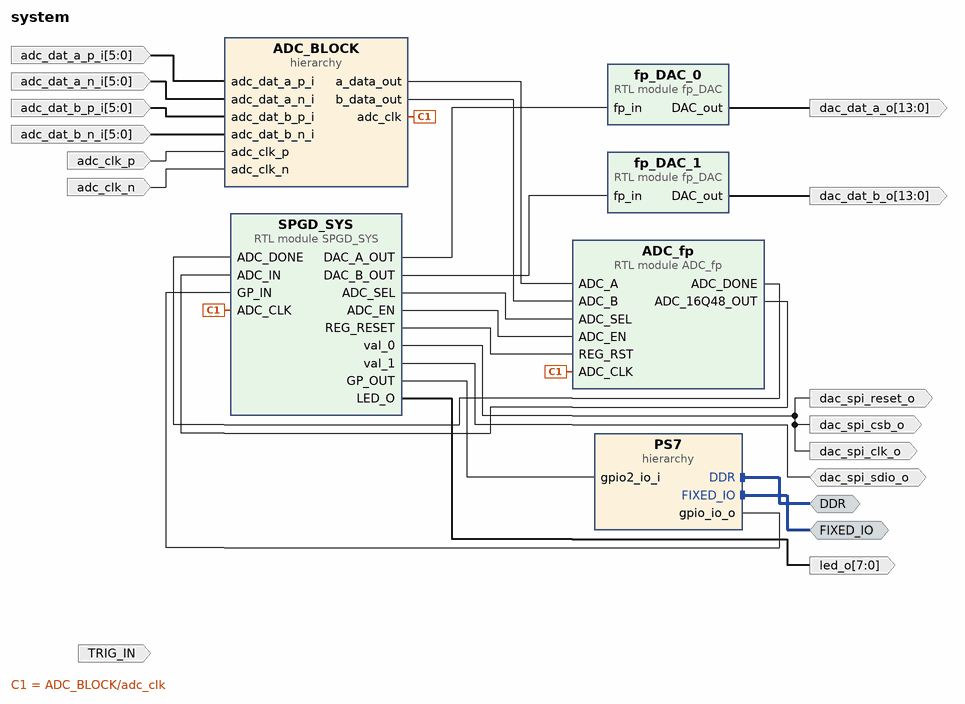
[diagram p0: block diagram of the top level]
# Vivado block design system, xc7z020clg400-3, Vivado 2020.1
create_bd_design system

create_bd_intf_port -mode Master -vlnv xilinx.com:interface:ddrx_rtl:1.0 DDR
create_bd_intf_port -mode Master -vlnv xilinx.com:display_processing_system7:fixedio_rtl:1.0 FIXED_IO
create_bd_port -dir I TRIG_IN
create_bd_port -dir I -from 5 -to 0 adc_dat_a_p_i
create_bd_port -dir I -from 5 -to 0 adc_dat_a_n_i
create_bd_port -dir I -from 5 -to 0 adc_dat_b_p_i
create_bd_port -dir I -from 5 -to 0 adc_dat_b_n_i
create_bd_port -dir I adc_clk_p
create_bd_port -dir I adc_clk_n
create_bd_port -dir O -from 13 -to 0 dac_dat_a_o
create_bd_port -dir O -from 13 -to 0 dac_dat_b_o
create_bd_port -dir O dac_spi_csb_o
create_bd_port -dir IO dac_spi_sdio_o
create_bd_port -dir O dac_spi_clk_o
create_bd_port -dir O dac_spi_reset_o
create_bd_port -dir O -from 7 -to 0 led_o

create_bd_cell -type hier PS7
create_bd_cell -type hier ADC_BLOCK
create_bd_cell -type module -reference ADC_fp ADC_fp
create_bd_cell -type module -reference fp_DAC fp_DAC_0
create_bd_cell -type module -reference fp_DAC fp_DAC_1
create_bd_cell -type module -reference SPGD_SYS SPGD_SYS

# ---- hierarchy /PS7 ----
current_bd_instance /PS7
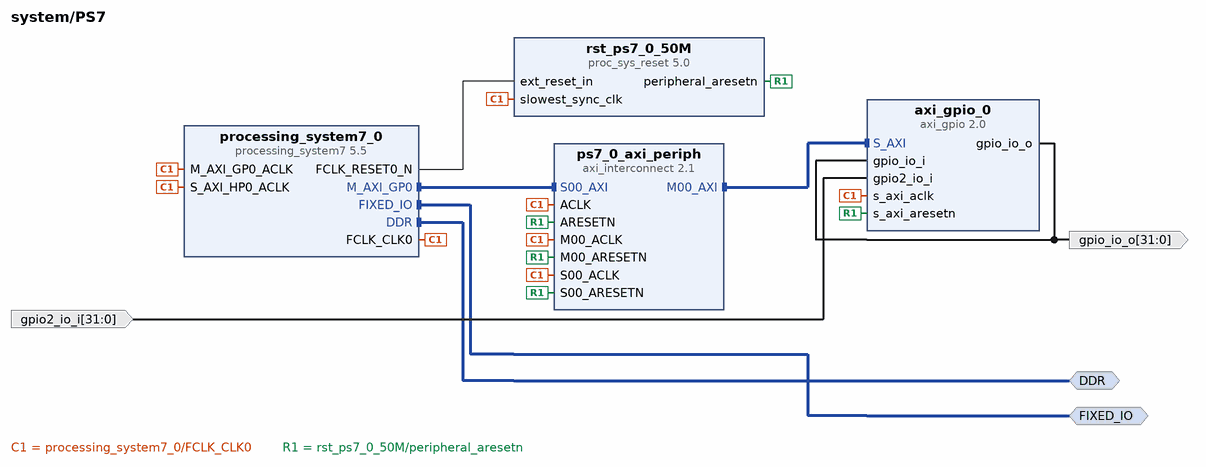
[diagram p1: block diagram inside /PS7]
create_bd_intf_pin -mode Master -vlnv xilinx.com:interface:ddrx_rtl:1.0 DDR
create_bd_intf_pin -mode Master -vlnv xilinx.com:display_processing_system7:fixedio_rtl:1.0 FIXED_IO
create_bd_pin -dir O -from 31 -to 0 gpio_io_o
create_bd_pin -dir I -from 31 -to 0 gpio2_io_i

create_bd_cell -type ip -vlnv xilinx.com:ip:processing_system7:5.5 processing_system7_0
set_property -dict {CONFIG.PCW_USE_S_AXI_HP0 1} [get_bd_cells processing_system7_0]
# 1 more settings of processing_system7_0 are not shown: defaults, MIO pin electricals, DDR timing, and values the tool derives
create_bd_cell -type ip -vlnv xilinx.com:ip:proc_sys_reset:5.0 rst_ps7_0_50M
create_bd_cell -type ip -vlnv xilinx.com:ip:axi_interconnect:2.1 ps7_0_axi_periph
set_property -dict {CONFIG.NUM_MI 1} [get_bd_cells ps7_0_axi_periph]
create_bd_cell -type ip -vlnv xilinx.com:ip:axi_gpio:2.0 axi_gpio_0
set_property -dict {CONFIG.C_ALL_INPUTS_2 1 CONFIG.C_IS_DUAL 1} [get_bd_cells axi_gpio_0]

# ---- hierarchy /ADC_BLOCK ----
current_bd_instance /ADC_BLOCK
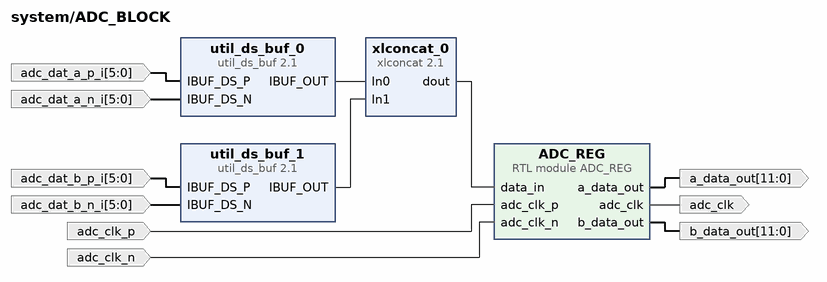
[diagram p2: block diagram inside /ADC_BLOCK]
create_bd_pin -dir I -from 5 -to 0 adc_dat_a_p_i
create_bd_pin -dir I -from 5 -to 0 adc_dat_a_n_i
create_bd_pin -dir I -from 5 -to 0 adc_dat_b_p_i
create_bd_pin -dir I -from 5 -to 0 adc_dat_b_n_i
create_bd_pin -dir I adc_clk_p
create_bd_pin -dir I adc_clk_n
create_bd_pin -dir O -from 11 -to 0 a_data_out
create_bd_pin -dir O -from 11 -to 0 b_data_out
create_bd_pin -dir O -type clk adc_clk

create_bd_cell -type ip -vlnv xilinx.com:ip:util_ds_buf:2.1 util_ds_buf_0
set_property -dict {CONFIG.C_SIZE 6} [get_bd_cells util_ds_buf_0]
create_bd_cell -type ip -vlnv xilinx.com:ip:util_ds_buf:2.1 util_ds_buf_1
set_property -dict {CONFIG.C_SIZE 6} [get_bd_cells util_ds_buf_1]
create_bd_cell -type ip -vlnv xilinx.com:ip:xlconcat:2.1 xlconcat_0
set_property -dict {CONFIG.IN0_WIDTH 6 CONFIG.IN1_WIDTH 6} [get_bd_cells xlconcat_0]
create_bd_cell -type module -reference ADC_REG ADC_REG

# ---- connections ----

current_bd_instance /PS7
connect_bd_intf_net [get_bd_intf_pins ps7_0_axi_periph/M00_AXI] [get_bd_intf_pins axi_gpio_0/S_AXI]
connect_bd_intf_net [get_bd_intf_pins FIXED_IO] [get_bd_intf_pins processing_system7_0/FIXED_IO]
connect_bd_intf_net [get_bd_intf_pins DDR] [get_bd_intf_pins processing_system7_0/DDR]
connect_bd_intf_net [get_bd_intf_pins processing_system7_0/M_AXI_GP0] [get_bd_intf_pins ps7_0_axi_periph/S00_AXI]
connect_bd_net [get_bd_pins processing_system7_0/FCLK_CLK0] \
  [get_bd_pins processing_system7_0/M_AXI_GP0_ACLK] [get_bd_pins processing_system7_0/S_AXI_HP0_ACLK] \
  [get_bd_pins ps7_0_axi_periph/S00_ACLK] [get_bd_pins rst_ps7_0_50M/slowest_sync_clk] [get_bd_pins axi_gpio_0/s_axi_aclk] \
  [get_bd_pins ps7_0_axi_periph/M00_ACLK] [get_bd_pins ps7_0_axi_periph/ACLK]
connect_bd_net [get_bd_pins processing_system7_0/FCLK_RESET0_N] [get_bd_pins rst_ps7_0_50M/ext_reset_in]
connect_bd_net [get_bd_pins rst_ps7_0_50M/peripheral_aresetn] \
  [get_bd_pins ps7_0_axi_periph/S00_ARESETN] [get_bd_pins axi_gpio_0/s_axi_aresetn] \
  [get_bd_pins ps7_0_axi_periph/M00_ARESETN] [get_bd_pins ps7_0_axi_periph/ARESETN]
connect_bd_net [get_bd_pins axi_gpio_0/gpio_io_o] [get_bd_pins gpio_io_o] [get_bd_pins axi_gpio_0/gpio_io_i]
connect_bd_net -net SPGD_SYS_GP_OUT [get_bd_pins gpio2_io_i] [get_bd_pins axi_gpio_0/gpio2_io_i]

current_bd_instance /ADC_BLOCK
connect_bd_net [get_bd_pins util_ds_buf_0/IBUF_OUT] [get_bd_pins xlconcat_0/In0]
connect_bd_net [get_bd_pins util_ds_buf_1/IBUF_OUT] [get_bd_pins xlconcat_0/In1]
connect_bd_net [get_bd_pins xlconcat_0/dout] [get_bd_pins ADC_REG/data_in]
connect_bd_net [get_bd_pins adc_dat_a_p_i] [get_bd_pins util_ds_buf_0/IBUF_DS_P]
connect_bd_net [get_bd_pins adc_dat_a_n_i] [get_bd_pins util_ds_buf_0/IBUF_DS_N]
connect_bd_net [get_bd_pins adc_dat_b_p_i] [get_bd_pins util_ds_buf_1/IBUF_DS_P]
connect_bd_net [get_bd_pins adc_dat_b_n_i] [get_bd_pins util_ds_buf_1/IBUF_DS_N]
connect_bd_net [get_bd_pins adc_clk_p] [get_bd_pins ADC_REG/adc_clk_p]
connect_bd_net [get_bd_pins adc_clk_n] [get_bd_pins ADC_REG/adc_clk_n]
connect_bd_net [get_bd_pins ADC_REG/a_data_out] [get_bd_pins a_data_out]
connect_bd_net [get_bd_pins ADC_REG/b_data_out] [get_bd_pins b_data_out]
connect_bd_net [get_bd_pins ADC_REG/adc_clk] [get_bd_pins adc_clk]

current_bd_instance /
connect_bd_intf_net -intf_net processing_system7_0_FIXED_IO [get_bd_intf_ports FIXED_IO] [get_bd_intf_pins PS7/FIXED_IO]
connect_bd_intf_net -intf_net processing_system7_0_DDR [get_bd_intf_ports DDR] [get_bd_intf_pins PS7/DDR]
connect_bd_net -net axi_gpio_0_gpio_io_o [get_bd_pins PS7/gpio_io_o] [get_bd_pins SPGD_SYS/GP_IN]
connect_bd_net [get_bd_ports adc_dat_a_p_i] [get_bd_pins ADC_BLOCK/adc_dat_a_p_i]
connect_bd_net [get_bd_ports adc_dat_a_n_i] [get_bd_pins ADC_BLOCK/adc_dat_a_n_i]
connect_bd_net [get_bd_ports adc_dat_b_p_i] [get_bd_pins ADC_BLOCK/adc_dat_b_p_i]
connect_bd_net [get_bd_ports adc_dat_b_n_i] [get_bd_pins ADC_BLOCK/adc_dat_b_n_i]
connect_bd_net [get_bd_ports adc_clk_p] [get_bd_pins ADC_BLOCK/adc_clk_p]
connect_bd_net [get_bd_ports adc_clk_n] [get_bd_pins ADC_BLOCK/adc_clk_n]
connect_bd_net -net ADC_REG_adc_clk [get_bd_pins ADC_BLOCK/adc_clk] [get_bd_pins ADC_fp/ADC_CLK] [get_bd_pins SPGD_SYS/ADC_CLK]
connect_bd_net [get_bd_pins SPGD_SYS/ADC_SEL] [get_bd_pins ADC_fp/ADC_SEL]
connect_bd_net [get_bd_pins SPGD_SYS/ADC_EN] [get_bd_pins ADC_fp/ADC_EN]
connect_bd_net -net ADC_REG_a_data_out [get_bd_pins ADC_BLOCK/a_data_out] [get_bd_pins ADC_fp/ADC_A]
connect_bd_net -net ADC_REG_b_data_out [get_bd_pins ADC_BLOCK/b_data_out] [get_bd_pins ADC_fp/ADC_B]
connect_bd_net [get_bd_pins ADC_fp/ADC_DONE] [get_bd_pins SPGD_SYS/ADC_DONE]
connect_bd_net [get_bd_pins ADC_fp/ADC_16Q48_OUT] [get_bd_pins SPGD_SYS/ADC_IN]
connect_bd_net [get_bd_pins SPGD_SYS/DAC_A_OUT] [get_bd_pins fp_DAC_0/fp_in]
connect_bd_net [get_bd_pins SPGD_SYS/DAC_B_OUT] [get_bd_pins fp_DAC_1/fp_in]
connect_bd_net [get_bd_pins SPGD_SYS/GP_OUT] [get_bd_pins PS7/gpio2_io_i]
connect_bd_net [get_bd_pins SPGD_SYS/val_0] [get_bd_ports dac_spi_clk_o] [get_bd_ports dac_spi_csb_o] [get_bd_ports dac_spi_reset_o]
connect_bd_net [get_bd_pins SPGD_SYS/val_1] [get_bd_ports dac_spi_sdio_o]
connect_bd_net [get_bd_pins fp_DAC_0/DAC_out] [get_bd_ports dac_dat_a_o]
connect_bd_net [get_bd_pins fp_DAC_1/DAC_out] [get_bd_ports dac_dat_b_o]
connect_bd_net [get_bd_pins SPGD_SYS/LED_O] [get_bd_ports led_o]
connect_bd_net [get_bd_pins SPGD_SYS/REG_RESET] [get_bd_pins ADC_fp/REG_RST]

# ---- address map ----
assign_bd_address -offset 0x42000000 -range 4K -target_address_space [get_bd_addr_spaces PS7/processing_system7_0/Data] [get_bd_addr_segs PS7/axi_gpio_0/S_AXI/Reg]

validate_bd_design
save_bd_design
